# Altium schematic sheet Sch_bai7.SchDoc
size A
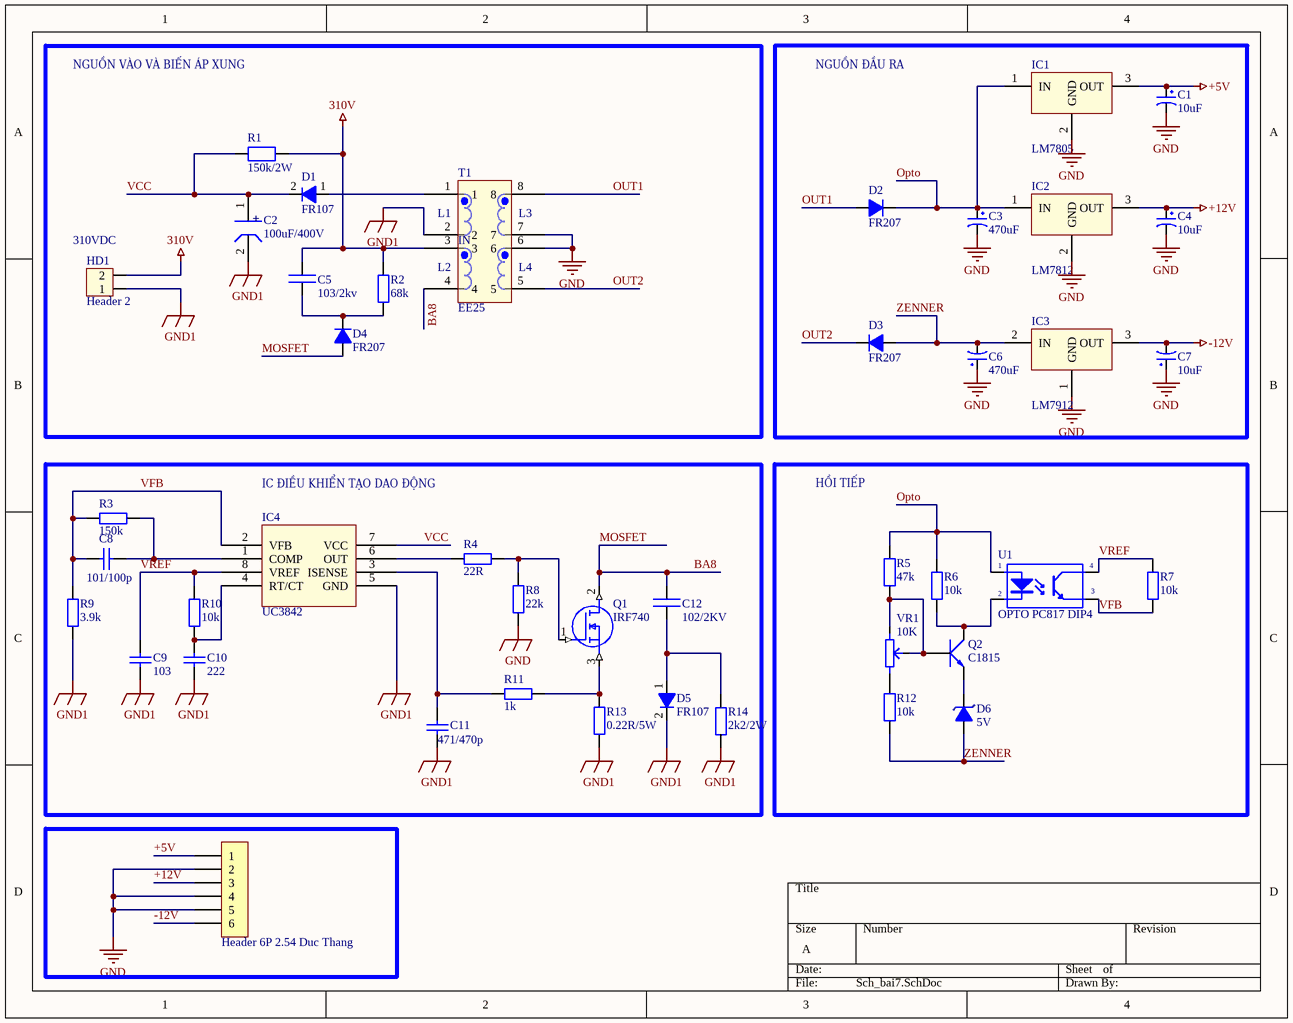
[diagram p0: Sch_bai7.SchDoc]

## Parts
C1  10uF  [tu hoa 4mm]
C2  100uF/400V  [Cap_100uF/400V]
C3  470uF  [tu hoa 10mm]
C4  10uF  [tu hoa 4mm]
C5  103/2kv  [Cap_103/2kv]
C6  470uF  [tu hoa 10mm]
C7  10uF  [tu hoa 4mm]
C8  101/100p  [tu gom]
C9  103  [tu gom]
C10  222  [tu gom]
C11  471/470p  [tu gom]
C12  102/2KV  [Cap_102_2KV]
D1  FR107  [Diode_FR107]
D2  FR207  [DIODE 2A]
D3  FR207  [DIODE 2A]
D4  FR207  [DIODE 2A]
D5  FR107  [Diode_FR107]
D6  5V  [D1A]
H1  Header 6P 2.54 Duc Thang  [XH2.54M-6]
HD1  Header 2  [HED2]
IC1  LM7805  [QTO-220]
IC2  LM7812  [LM7812]
IC3  LM7912  [LM7912]
IC4  UC3842  [UC3842_DIP]
Q1  IRF740  [IRF740]
Q2  C1815  [TO92]
R1  150k/2W  [Tro Vach 2W]
R2  68k  [tro vach 1/4w]
R3  150k  [Tro vach 1/4w]
R4  22R  [tro vach 1/4w]
R5  47k  [tro vach 1/4w]
R6  10k  [tro vach 1/4w]
R7  10k  [tro vach 1/4w]
R8  22k  [tro vach 1/4w]
R9  3.9k  [tro vach 1/4w]
R10  10k  [tro vach 1/4w]
R11  1k  [tro vach 1/4w]
R12  10k  [tro vach 1/4w]
R13  0.22R/5W  [tro cong suat 5w]
R14  2k2/2W  [Tro Vach 2W]
T1  EE25  [EE25_8_PIN]
U1  OPTO PC817 DIP4  [DIP4]
VR1  10K  [Bien Tro Tam Giac Dung]

## Blocks framed on the sheet
NGUỒN ĐẦU RA: C1 C3 C4 C6 C7 D2 D3 IC1-IC3
IC ĐIỀU KHIỂN TẠO DAO ĐỘNG: C8-C12 D5 IC4 Q1 R3 R4 R8-R11 R13 R14
HỒI TIẾP: D6 Q2 R5-R7 R12 U1 VR1

## Nets
310V: C5.2 HD1.2 R1.2 R2.2 T1.3
+5V: C1.1 H1.1 IC1.3(OUT)
+12V: C4.1 H1.3 IC2.3(OUT)
-12V: C7.2 H1.6 IC3.3(OUT)
GND: C1.2 C3.2 C4.2 C6.1 C7.1 H1.2 H1.4 H1.5 IC1.2(GND) IC2.2(GND) IC3.1(GND) R8.1 T1.6 T1.7
GND1: C2.2 C9.2 C10.2 C11.2 D5.2 HD1.1 IC4.5(GND) R9.1 R13.1 R14.1 T1.2
BA8: C12.2 D4.1(A) Q1.2(D) T1.4  [also labelled MOSFET]
Opto: C3.1 D2.2(K) IC1.1(IN) IC2.1(IN) R5.2 R6.1 U1.1(A)
OUT1: D2.1(A) T1.8
OUT2: D3.2(K) T1.5
VCC: C2.1 D1.2 IC4.7(VCC) R1.1
VFB: C8.1 IC4.2(VFB) R3.2 R7.2 R9.2 U1.3(E)
VREF: C9.1 IC4.8(VREF) R7.1 R10.1 U1.4(C)
ZENNER: C6.2 D3.1(A) D6.1(A) IC3.2(IN) R12.2
NetC5_1: C5.1 D4.2(K) R2.1
NetC8_2: C8.2 IC4.1(COMP) R3.1
NetC10_1: C10.1 IC4.4(RT/CT) R10.2
NetC11_1: C11.1 IC4.3(ISENSE) R11.1
NetC12_1: C12.1 D5.1 R14.2
NetD1_1: D1.1 T1.1
NetD6_2: D6.2(K) Q2.1(E)
NetIC4_6: IC4.6(OUT) R4.1
NetQ1_1: Q1.1(G) R4.2 R8.2
NetQ1_3: Q1.3(S) R11.2 R13.2
NetQ2_2: Q2.2(C) R6.2 U1.2(K)
NetQ2_3: Q2.3(B) R5.1 VR1.1 VR1.2
NetR12_1: R12.1 VR1.3

## Notes on the sheet
- NGUỒN VÀO VÀ BIẾN ÁP XUNG
- (near T1) L1
- (near T1) L3
- (near HD1) 310VDC
- (near T1) L2
- (near T1) L4
- (in symbol cap_100uF/400V) +
- (in symbol Transformer EE25_8pin) IN

## Library data of the parts
C1 C4 C7 = Tu Hoa 10uF 25V 4x7: Cắm; So_Chan: 2; Ten_Linh_Kien: Tụ Hóa 10uF 25V 4x7MM; Don_Vi: Con; Ma_Hang: MH001349; Chung_Loai: Cắm; Kieu_Chan: *
C2 = cap_100uF/400V
C3 C6 = Tu Hoa 470uF 50V 10x17: Cắm; Don_Vi: Con; So_Chan: 2; Ten_Linh_Kien: Tụ Hóa 470uF 50V; Ma_Hang: MH006866; Chung_Loai: Cắm; Kieu_Chan: *
C5 = cap_103/2kv
C8 = Tu gom 101 50V: Cắm; Don_Vi: Con; So_Chan: 2; Ten_Linh_Kien: Tụ gốm 101 0.1nF 50V; Ma_Hang: MH004764; Chung_Loai: Cắm; Kieu_Chan: *
C9 = Tu gom 103 50V: Cắm; So_Chan: 2; Ten_Linh_Kien: Tụ gốm 103 10nF 50V; Don_Vi: Con; Ma_Hang: MH000936; Chung_Loai: Cắm; Kieu_Chan: *
C10 = Tu gom 222 50V: Cắm; Don_Vi: Con; So_Chan: 2; Ten_Linh_Kien: Tụ gốm 222-2.2nF 50V; Ma_Hang: MH004770; Chung_Loai: Cắm; Kieu_Chan: *
C11 = Tu gom 471 50V: Cắm; Don_Vi: Con; So_Chan: 2; Ten_Linh_Kien: Tụ gốm 470P 471 50V; Ma_Hang: MH004776; Chung_Loai: Cắm; Kieu_Chan: *
C12 = Cap_102/2KV: Tụ cao áp
D1 D5 = Diode_FR107
D2-D4 = Diode FR207: Cắm; Ten_Linh_Kien: Diode FR207 2A 1000V ( DIP); Don_Vi: Con; Ma_Hang: MH005704; Ghi Chu: *; Kieu_Chan: *; Chung_Loai: Cắm
D6 = Zener
H1 = Header 6P 2.54 Duc Thang: Cắm; Ten_Linh_Kien: Header 6P XH2.54-6P Đực Thẳng; Don_Vi: Con; Ma_Hang: MH001972; Chung_Loai: Cắm
HD1 = Hed2: Header 2 (Green); Value: Header 2
IC1 = LM78xx: On ap +, from + 5 to + 24VDC; Value: LM7805
Q2 = C1815: NPN transistor; Value: C9014
R1 = Res_150k/2W
R2 = Tro Vach 1/4W 5% 68k: Cắm; Don_Vi: Con; So_Chan: 2; Ten_Linh_Kien: Trở Vạch 1/4w 5% 68k; Ma_Hang: MH007332; Kieu_Chan: *; Chung_Loai: Cắm
R3 = Tro Vach 1/4W 5% 150k: Cắm; Don_Vi: Con; So_Chan: 2; Ten_Linh_Kien: Trở Vạch 1/4w 5% 150k; Ma_Hang: MH007286; Chung_Loai: Cắm; Kieu_Chan: *
R4 = Tro Vach 1/4W 5% 22R: Cắm; Don_Vi: Con; So_Chan: 2; Ten_Linh_Kien: Trở Vạch 1/4w 5% 22R; Ma_Hang: MH007302; Chung_Loai: Cắm; Kieu_Chan: *
R5 = Tro Vach 1/4W 5% 47k: Cắm; Don_Vi: Con; So_Chan: 2; Ten_Linh_Kien: Trở Vạch 1/4w 5% 47k; Ma_Hang: MH004982; Chung_Loai: Cắm; Kieu_Chan: *
R6 R7 R10 R12 = Tro Vach 1/4W 5% 10k: Căm; Chung_Loai: Cắm; Don_Vi: Con; So_Chan: 2; Ten_Linh_Kien: Trở Vạch 1/4w 5% 10K; Ma_Hang: MH007354; Kieu_Chan: *
R8 = Tro Vach 1/4W 5% 22k: Cắm; Don_Vi: Con; So_Chan: 2; Ten_Linh_Kien: Trở Vạch 1/4w 5% 22k; Ma_Hang: MH007301; Chung_Loai: Cắm; Kieu_Chan: *
R9 = Tro Vach 1/4W 5% 3.9k: Cắm; Don_Vi: Con; So_Chan: 2; Ten_Linh_Kien: Trở Vạch 1/4w 5% 3.9K; Ma_Hang: MH007307; Chung_Loai: Cắm; Kieu_Chan: *
R11 = Tro Vach 1/4W 5% 1k: Cắm; Don_Vi: Con; So_Chan: 2; Ten_Linh_Kien: Trở Vạch 1/4w 5% 1k; Ma_Hang: MH007390; Chung_Loai: Cắm; Kieu_Chan: *
R13 = Tro Cong Suat 5W 5% 0.22R: Cắm; Don_Vi: Con; So_Chan: 2; Ten_Linh_Kien: Trở Sứ 5w 5% 0.22R; Ma_Hang: MH001094; Chung_Loai: Cắm; Kieu_Chan: *
R14 = res-2k2/2W
T1 = Transformer EE25_8pin
U1 = OPTO PC817 DIP4: Single Opto; Value: PC817
VR1 = Bien tro tam giac 10K Dung: Cắm; Ma_Hang: MH000919; Don_Vi: Con; Ten_Linh_Kien: Biến Trở Tam Giác 103-10K RM065 (Chân Đứng); Chung_Loai: Cắm; Kieu_Chan: *